# Altium schematic sheet FPGA_Bank_66_HP.SchDoc: Sayma AMC
size 420 x 297 mm; $$Internal___BlkDate: 0:12:25_2-9-18; $$Internal_NAME_PLACEHOLDER: a3sheet; $$Internal_Resolution: 00001mm; $$NotCommonProperty_@NAME: FPGA_XCKU040FFVA1156; $$NotCommonProperty_@PRINTORDER: 20; $$NotCommonProperty_@SHEET: FPGA Bank 66 HP; $$NotCommonProperty_@SHEETTOTAL: 30; CmpIndex: 992; Drawing Author: G.Kasprowicz; Drawing Number: Sayma AMC; Drawing Project: AMC FMC Carrier Board; Drawing Revision: 2.0; SymIndex: 2141; CheckedBy: P.Kulik,T.Przywozki,W.Ruclo; Author: G.Kasprowicz; CompanyName: WUT ISE; DrawnBy: G.Kasprowicz; Organization: WUT ISE; Address1: PW ISE; Address2: Nowowiejska 15/19 00-665 Warsaw; Address3: gkasprow@gmail.com; DocumentNumber: 22; Revision: 2; SheetNumber: 22; SheetTotal: 32; ModifiedBy: -; CheckedDate: -; Title2: FPGA bank 66 (RTM LVDS); DivGrp: WUT ISE; Designer: G.Kasprowicz; ModifiedDate: -; ProjectName: Sensor Box
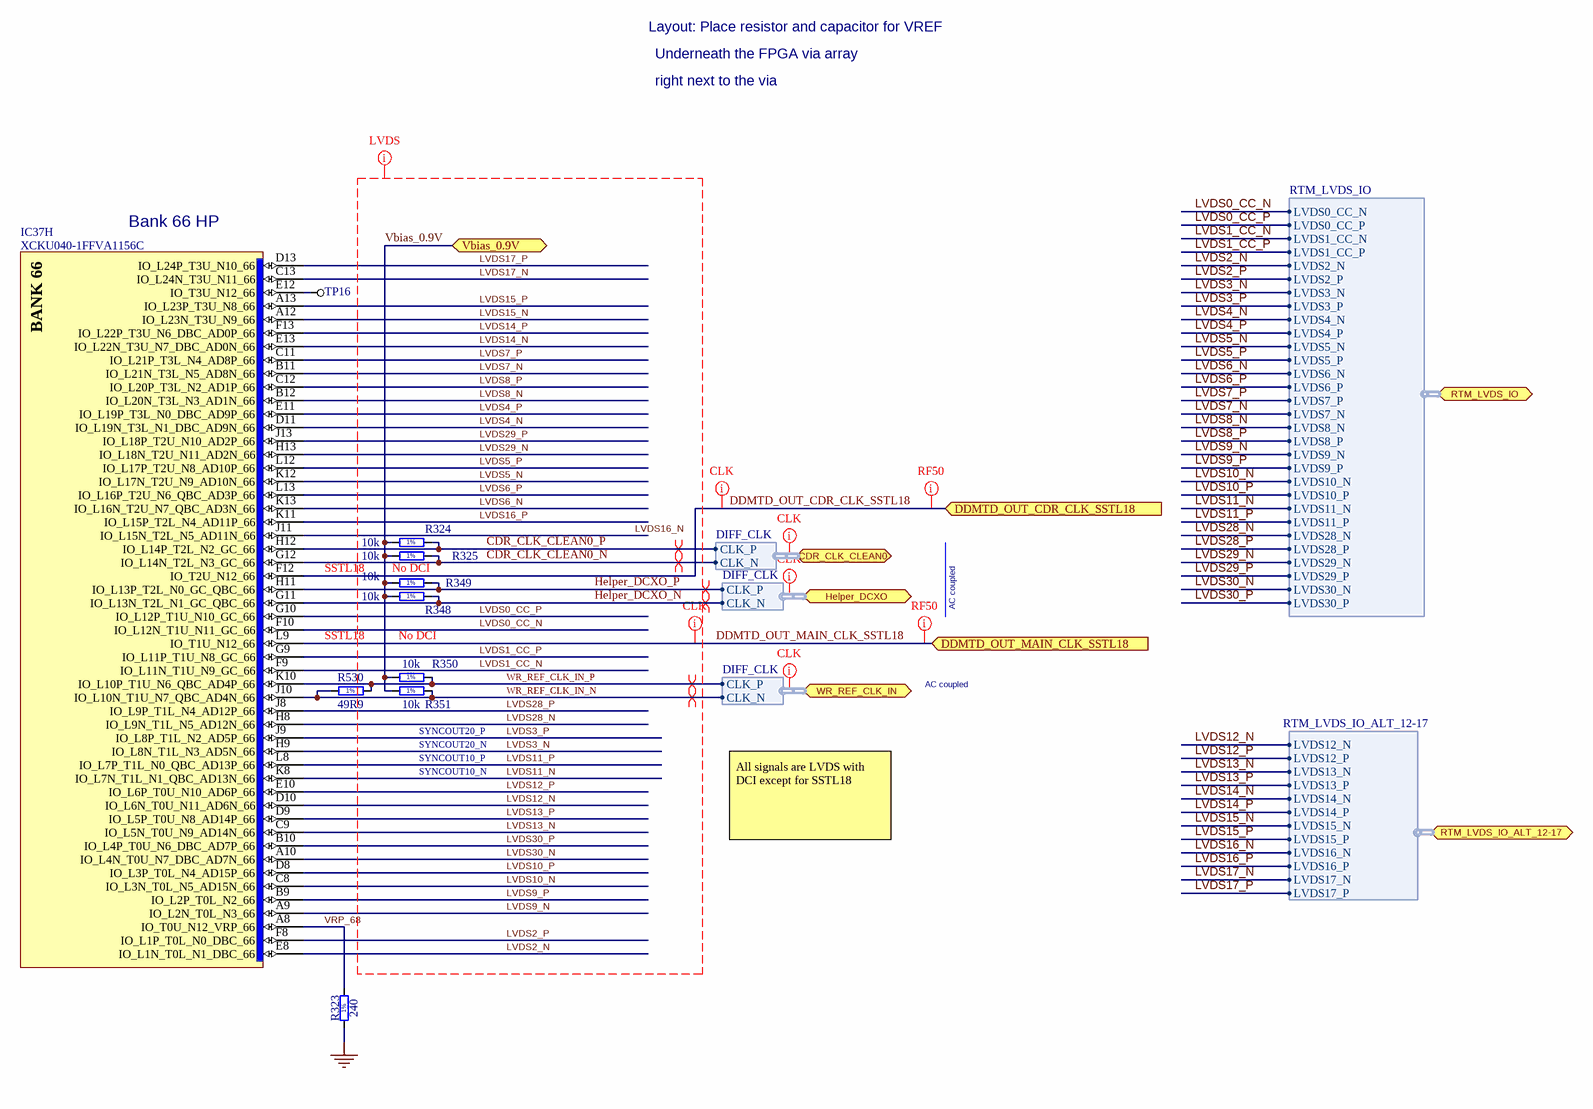
[diagram p0: FPGA_Bank_66_HP.SchDoc]

## Parts
IC37  XCKU040-1FFVA1156C  [BGA1156C100P34X34_3500X3500X350]  (part H of 22)
R323  240  [RESC1005X40N]
R324  10k  [RESC1005X40N]
R325  10k  [RESC1005X40N]
R348  10k  [RESC1005X40N]
R349  10k  [RESC1005X40N]
R350  10k  [RESC1005X40N]
R351  10k  [RESC1005X40N]
R530  49R9  [RESC1005X40N]
TP16  TP  [TP]  (value not drawn)

## Ports
CDR_CLK_CLEAN0 (bidir, harness DIFF_CLK), DDMTD_OUT_CDR_CLK_SSTL18 (in), DDMTD_OUT_MAIN_CLK_SSTL18 (in), Helper_DCXO (bidir, harness DIFF_CLK), RTM_LVDS_IO (bidir, harness RTM_LVDS_IO), RTM_LVDS_IO_ALT_12-17 (bidir, harness RTM_LVDS_IO_ALT_12-17), Vbias_0.9V (bidir), WR_REF_CLK_IN (bidir, harness DIFF_CLK)

## Harnesses
RTM_LVDS_IO: LVDS0_CC_N, LVDS0_CC_P, LVDS1_CC_N, LVDS1_CC_P, LVDS2_N, LVDS2_P, LVDS3_N, LVDS3_P, LVDS4_N, LVDS4_P, LVDS5_N, LVDS5_P, LVDS6_N, LVDS6_P, LVDS7_P, LVDS7_N, LVDS8_N, LVDS8_P, LVDS9_N, LVDS9_P, LVDS10_N, LVDS10_P, LVDS11_N, LVDS11_P, LVDS28_N, LVDS28_P, LVDS29_N, LVDS29_P, LVDS30_N, LVDS30_P
RTM_LVDS_IO_ALT_12-17: LVDS12_N, LVDS12_P, LVDS13_N, LVDS13_P, LVDS14_N, LVDS14_P, LVDS15_N, LVDS15_P, LVDS16_N, LVDS16_P, LVDS17_N, LVDS17_P
DIFF_CLK: CLK_N, CLK_P

## Nets
GND: R323.1
CDR_CLK_CLEAN0_N: IC37.G12(IO_L14N_T2L_N3_GC_66) R325.2 ; port CDR_CLK_CLEAN0.CLK_N
CDR_CLK_CLEAN0_P: IC37.H12(IO_L14P_T2L_N2_GC_66) R324.2 ; port CDR_CLK_CLEAN0.CLK_P
DDMTD_OUT_CDR_CLK_SSTL18: IC37.F12(IO_T2U_N12_66) ; port DDMTD_OUT_CDR_CLK_SSTL18
DDMTD_OUT_MAIN_CLK_SSTL18: IC37.L9(IO_T1U_N12_66) ; port DDMTD_OUT_MAIN_CLK_SSTL18
Helper_DCXO_N: IC37.G11(IO_L13N_T2L_N1_GC_QBC_66) R349.2 ; port Helper_DCXO.CLK_N
Helper_DCXO_P: IC37.H11(IO_L13P_T2L_N0_GC_QBC_66) R348.2 ; port Helper_DCXO.CLK_P
LVDS0_CC_N: IC37.F10(IO_L12N_T1U_N11_GC_66) ; port RTM_LVDS_IO.LVDS0_CC_N
LVDS0_CC_P: IC37.G10(IO_L12P_T1U_N10_GC_66) ; port RTM_LVDS_IO.LVDS0_CC_P
LVDS1_CC_N: IC37.F9(IO_L11N_T1U_N9_GC_66) ; port RTM_LVDS_IO.LVDS1_CC_N
LVDS1_CC_P: IC37.G9(IO_L11P_T1U_N8_GC_66) ; port RTM_LVDS_IO.LVDS1_CC_P
LVDS2_N: IC37.E8(IO_L1N_T0L_N1_DBC_66) ; port RTM_LVDS_IO.LVDS2_N
LVDS2_P: IC37.F8(IO_L1P_T0L_N0_DBC_66) ; port RTM_LVDS_IO.LVDS2_P
LVDS3_N: IC37.H9(IO_L8N_T1L_N3_AD5N_66) ; port RTM_LVDS_IO.LVDS3_N
LVDS3_P: IC37.J9(IO_L8P_T1L_N2_AD5P_66) ; port RTM_LVDS_IO.LVDS3_P
LVDS4_N: IC37.D11(IO_L19N_T3L_N1_DBC_AD9N_66) ; port RTM_LVDS_IO.LVDS4_N
LVDS4_P: IC37.E11(IO_L19P_T3L_N0_DBC_AD9P_66) ; port RTM_LVDS_IO.LVDS4_P
LVDS5_N: IC37.K12(IO_L17N_T2U_N9_AD10N_66) ; port RTM_LVDS_IO.LVDS5_N
LVDS5_P: IC37.L12(IO_L17P_T2U_N8_AD10P_66) ; port RTM_LVDS_IO.LVDS5_P
LVDS6_N: IC37.K13(IO_L16N_T2U_N7_QBC_AD3N_66) ; port RTM_LVDS_IO.LVDS6_N
LVDS6_P: IC37.L13(IO_L16P_T2U_N6_QBC_AD3P_66) ; port RTM_LVDS_IO.LVDS6_P
LVDS7_N: IC37.B11(IO_L21N_T3L_N5_AD8N_66) ; port RTM_LVDS_IO.LVDS7_N
LVDS7_P: IC37.C11(IO_L21P_T3L_N4_AD8P_66) ; port RTM_LVDS_IO.LVDS7_P
LVDS8_N: IC37.B12(IO_L20N_T3L_N3_AD1N_66) ; port RTM_LVDS_IO.LVDS8_N
LVDS8_P: IC37.C12(IO_L20P_T3L_N2_AD1P_66) ; port RTM_LVDS_IO.LVDS8_P
LVDS9_N: IC37.A9(IO_L2N_T0L_N3_66) ; port RTM_LVDS_IO.LVDS9_N
LVDS9_P: IC37.B9(IO_L2P_T0L_N2_66) ; port RTM_LVDS_IO.LVDS9_P
LVDS10_N: IC37.C8(IO_L3N_T0L_N5_AD15N_66) ; port RTM_LVDS_IO.LVDS10_N
LVDS10_P: IC37.D8(IO_L3P_T0L_N4_AD15P_66) ; port RTM_LVDS_IO.LVDS10_P
LVDS11_N: IC37.K8(IO_L7N_T1L_N1_QBC_AD13N_66) ; port RTM_LVDS_IO.LVDS11_N
LVDS11_P: IC37.L8(IO_L7P_T1L_N0_QBC_AD13P_66) ; port RTM_LVDS_IO.LVDS11_P
LVDS12_N: IC37.D10(IO_L6N_T0U_N11_AD6N_66) ; port RTM_LVDS_IO_ALT_12-17.LVDS12_N
LVDS12_P: IC37.E10(IO_L6P_T0U_N10_AD6P_66) ; port RTM_LVDS_IO_ALT_12-17.LVDS12_P
LVDS13_N: IC37.C9(IO_L5N_T0U_N9_AD14N_66) ; port RTM_LVDS_IO_ALT_12-17.LVDS13_N
LVDS13_P: IC37.D9(IO_L5P_T0U_N8_AD14P_66) ; port RTM_LVDS_IO_ALT_12-17.LVDS13_P
LVDS14_N: IC37.E13(IO_L22N_T3U_N7_DBC_AD0N_66) ; port RTM_LVDS_IO_ALT_12-17.LVDS14_N
LVDS14_P: IC37.F13(IO_L22P_T3U_N6_DBC_AD0P_66) ; port RTM_LVDS_IO_ALT_12-17.LVDS14_P
LVDS15_N: IC37.A12(IO_L23N_T3U_N9_66) ; port RTM_LVDS_IO_ALT_12-17.LVDS15_N
LVDS15_P: IC37.A13(IO_L23P_T3U_N8_66) ; port RTM_LVDS_IO_ALT_12-17.LVDS15_P
LVDS16_N: IC37.J11(IO_L15N_T2L_N5_AD11N_66) ; port RTM_LVDS_IO_ALT_12-17.LVDS16_N
LVDS16_P: IC37.K11(IO_L15P_T2L_N4_AD11P_66) ; port RTM_LVDS_IO_ALT_12-17.LVDS16_P
LVDS17_N: IC37.C13(IO_L24N_T3U_N11_66) ; port RTM_LVDS_IO_ALT_12-17.LVDS17_N
LVDS17_P: IC37.D13(IO_L24P_T3U_N10_66) ; port RTM_LVDS_IO_ALT_12-17.LVDS17_P
LVDS28_N: IC37.H8(IO_L9N_T1L_N5_AD12N_66) ; port RTM_LVDS_IO.LVDS28_N
LVDS28_P: IC37.J8(IO_L9P_T1L_N4_AD12P_66) ; port RTM_LVDS_IO.LVDS28_P
LVDS29_N: IC37.H13(IO_L18N_T2U_N11_AD2N_66) ; port RTM_LVDS_IO.LVDS29_N
LVDS29_P: IC37.J13(IO_L18P_T2U_N10_AD2P_66) ; port RTM_LVDS_IO.LVDS29_P
LVDS30_N: IC37.A10(IO_L4N_T0U_N7_DBC_AD7N_66) ; port RTM_LVDS_IO.LVDS30_N
LVDS30_P: IC37.B10(IO_L4P_T0U_N6_DBC_AD7P_66) ; port RTM_LVDS_IO.LVDS30_P
Vbias_0.9V: R324.1 R325.1 R348.1 R349.1 R350.1 R351.1 ; port Vbias_0.9V
VRP_68: IC37.A8(IO_T0U_N12_VRP_66) R323.2
WR_REF_CLK_IN_N: IC37.J10(IO_L10N_T1U_N7_QBC_AD4N_66) R351.2 R530.1 ; port WR_REF_CLK_IN.CLK_N
WR_REF_CLK_IN_P: IC37.K10(IO_L10P_T1U_N6_QBC_AD4P_66) R350.2 R530.2 ; port WR_REF_CLK_IN.CLK_P
NetIC37_E12: IC37.E12(IO_T3U_N12_66) TP16.1

## Layout directives
net class LVDS: CDR_CLK_CLEAN0_N, CDR_CLK_CLEAN0_P, Helper_DCXO_N, Helper_DCXO_P, LVDS0_CC_N, LVDS0_CC_P, LVDS1_CC_N, LVDS1_CC_P, LVDS2_N, LVDS2_P, LVDS3_N, LVDS3_P, LVDS4_N, LVDS4_P, LVDS5_N, LVDS5_P, LVDS6_N, LVDS6_P, LVDS7_N, LVDS7_P, LVDS8_N, LVDS8_P, LVDS9_N, LVDS9_P, LVDS10_N, LVDS10_P, LVDS11_N, LVDS11_P, LVDS12_N, LVDS12_P, LVDS13_N, LVDS13_P, LVDS14_N, LVDS14_P, LVDS15_N, LVDS15_P, LVDS16_N, LVDS16_P, LVDS17_N, LVDS17_P, LVDS28_N, LVDS28_P, LVDS29_N, LVDS29_P, LVDS30_N, LVDS30_P, Vbias_0.9V, WR_REF_CLK_IN_N, WR_REF_CLK_IN_P
differential pair: CDR_CLK_CLEAN0_N, CDR_CLK_CLEAN0_P, Helper_DCXO_N, Helper_DCXO_P, WR_REF_CLK_IN_N, WR_REF_CLK_IN_P
net class RF50: DDMTD_OUT_CDR_CLK_SSTL18, DDMTD_OUT_MAIN_CLK_SSTL18
net class CLK: (no net found under the mark), DDMTD_OUT_CDR_CLK_SSTL18, DDMTD_OUT_MAIN_CLK_SSTL18

## Notes on the sheet
- Layout: Place resistor and capacitor for VREF
- Underneath the FPGA via array
- right next to the via
- Bank 66 HP
- SSTL18
- No DCI
- AC coupled
- SYNCOUT20_P
- SYNCOUT20_N
- SYNCOUT10_P
- SYNCOUT10_N
- All signals are LVDS with DCI except for SSTL18
- Project/Equipment
- Document
- Designer
- Drawn by
- Check.by
- Copyright WUT ISE 2018.
  This documentation describes Open Hardware and is licensed under the CERN OHL v.1.1. You may redistribute and modify this documentation under the terms of the CERN OHL v.1.1. (http://ohwr.org/CERNOHL). This documentation is distributed WITHOUT ANY EXPRESS OR IMPLIED WARRANTY, INCLUDING OF MERCHANTABILITY, SATISFACTORY QUALITY AND FITNESS FOR A PARTICULAR PURPOSE. Please see the CERN OHL v.1.1 for applicable conditions.
- Contact
- File
- Last Mod.
- Print Date
- Sheet
- Size
- A3
- of
- Rev
- (in symbol R0402_10K_1%_0.0625W_100PPM) 1%
- (in symbol R0402_49R9_1%_0.0625W_100PPM) 1%
- (in symbol R0402_240R_1%_0.0625W_100PPM) 1%
- (in symbol XCKU040-1FFVA1156C, part H) BANK 66

## Library data of the parts
IC37 = XCKU040-1FFVA1156C: Kintex UltraScale FPGA, 520 I/O, 530K Cells, 1156-Ball BGA, Speed Grade 1, Commercial Grade; Manufacturer: XILINX; Part Description: Kintex UltraScale, 40 DLL I/O, 416 HP I/O, 104 HR I/O, 1156-Pin BGA, Speed Grade 1, Commercial Grade; PressFit: No; Bonding: No; PackageDescription: BGA, 1.00mm Pitch, Square; 1156 Pin, 34 Columns X 34 Rows, Body 35.00mm X 35.00mm X 3.50mm H, IPC Medium Density; Part Number: XCKU040-1FFVA1156C; Component Kind: Standard; Component Type: Standard; Device: XCKU040-1FFVA1156C; Manufacturer Part Number: XCKU040-1FFVA1156C; Pin Count: 1156; Case: BGA1156; Mounted: Yes; Socket: No; SMD: Yes; Sense: No; ComponentHeight: 3.5mm; HelpURL: \\cern.ch\dfs\Applications\Altium\Datasheets\XCKU040-1FFVA1156C.pdf; ComponentLink1URL: \\cern.ch\dfs\Applications\Altium\Datasheets\XCKU040-1FFVA1156C_Package-Pinout.pdf; ComponentLink1Description: Package/Pinout; Author: CERN DEM CA; CreateDate: 16.08.2016; LatestRevisionDate: 16.08.2016
R323 = R0402_240R_1%_0.0625W_100PPM: Resistor - 1%; Manufacturer: GENERIC; Part Description: General Purpose Thick Film Chip Resistor; Manufacturer1 Part Number: 232270672401L; TC: ±100ppm/°C; PressFit: No; Manufacturer Part Number: R0402_240R_1%_0.0625W_100PPM; Part Number: R0402_240R_1%_0.0625W_100PPM; Tolerance: ±1%; Value: 240; Component Kind: Standard; Component Type: Standard; Pin Count: 2; Status: Not Recommended; Power: 0.0625W; Case: 0402; Mounted: Yes; Sense: No; Socket: No; SMD: Yes; Manufacturer1 Example: YAGEO PHYCOMP; Manufacturer1 ComponentHeight: 0.4mm; HelpURL: \\cern.ch\dfs\Applications\Altium\Datasheets\R0402_Phycomp_RC0402.pdf; Author: CERN DEM JLC; CreateDate: 03.12.2007; LatestRevisionDate: 17.10.2012
R324 R325 R348-R351 = R0402_10K_1%_0.0625W_100PPM: Resistor - 1%; Manufacturer: GENERIC; Part Description: General Purpose Thick Film Chip Resistor; Manufacturer1 Part Number: 232270671003L; TC: ±100ppm/°C; PressFit: No; Manufacturer Part Number: R0402_10K_1%_0.0625W_100PPM; Part Number: R0402_10K_1%_0.0625W_100PPM; Tolerance: ±1%; Value: 10k; Component Kind: Standard; Component Type: Standard; Pin Count: 2; Status: Not Recommended; Power: 0.0625W; Case: 0402; Mounted: Yes; Sense: No; Socket: No; SMD: Yes; Manufacturer1 Example: YAGEO PHYCOMP; Manufacturer1 ComponentHeight: 0.4mm; HelpURL: \\cern.ch\dfs\Applications\Altium\Datasheets\R0402_Phycomp_RC0402.pdf; Author: CERN DEM JLC; CreateDate: 03.12.2007; LatestRevisionDate: 17.10.2012
R530 = R0402_49R9_1%_0.0625W_100PPM: Resistor - 1%; Manufacturer: GENERIC; Part Description: General Purpose Thick Film Chip Resistor; Manufacturer1 Part Number: 232270674999L or RC0402FR-0749R9L; TC: ±100ppm/°C; PressFit: No; Manufacturer Part Number: R0402_49R9_1%_0.0625W_100PPM; Part Number: R0402_49R9_1%_0.0625W_100PPM; Tolerance: ±1%; Value: 49R9; Component Kind: Standard; Component Type: Standard; Pin Count: 2; Status: Not Recommended; Power: 0.0625W; Case: 0402; Mounted: Yes; Sense: No; Socket: No; SMD: Yes; Manufacturer1 Example: YAGEO PHYCOMP; Manufacturer1 ComponentHeight: 0.4mm; HelpURL: \\cern.ch\dfs\Applications\Altium\Datasheets\R0402_Phycomp_RC0402.pdf; Author: CERN DEM JLC; CreateDate: 24.10.2012; LatestRevisionDate: 24.10.2012
TP16 = TP: Testpoint